# EAGLE schematic simple_sstc_halfbridge (EAGLE 9.6.2)
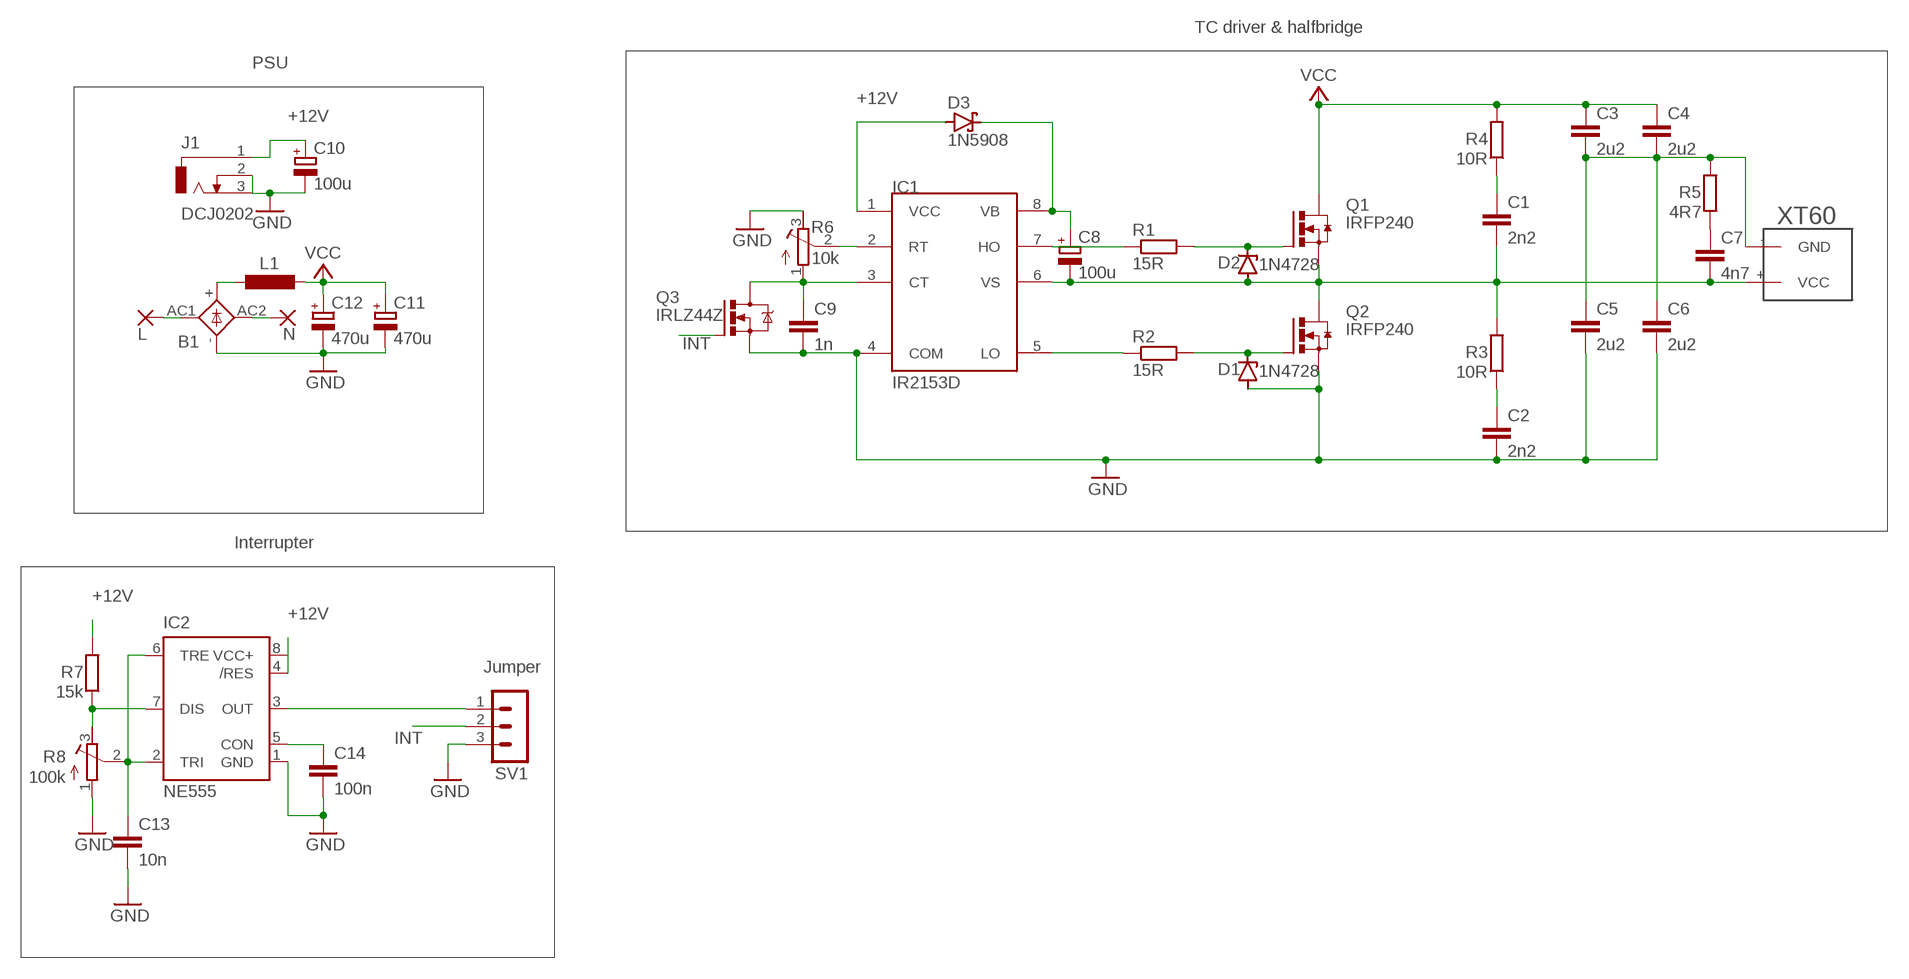
[diagram p0: schematic, sheet 1]

## Parts
B1  2KBP  [2KBP]
C1  2n2  C7.5/3  [C7.5B3]
C2  2n2  C7.5/3  [C7.5B3]
C3  2u2  C22/6  [C22.5B6]
C4  2u2  C22/6  [C22.5B6]
C5  2u2  C22/6  [C22.5B6]
C6  2u2  C22/6  [C22.5B6]
C7  4n7  C7.5/3  [C7.5B3]
C8  100u  CPOL-EUE2.5-7  [E2,5-7]
C9  1n  C-EU025-024X044  [C025-024X044]
C10  100u  CPOL-EUE2.5-7  [E2,5-7]
C11  470u  CPOL-EUE10-35  [EB35D]
C12  470u  CPOL-EUE10-35  [EB35D]
C13  10n  C-EU025-025X050  [C025-025X050]
C14  100n  C-EU025-025X050  [C025-025X050]
D1  1N4728  [DO41Z10]
D2  1N4728  [DO41Z10]
D3  1N5908  [C4111-15]
IC1  IR2153D  [DIL08]
IC2  NE555  [DIL-08]
J1  DCJ0202  [DCJ0202]
L  3,81/1,4  [3,81/1,4]
L1  L-EUTJ4-U2  [TJ4-U2]
N  3,81/1,4  [3,81/1,4]
Q1  IRFP240  [TO247BV]
Q2  IRFP240  [TO247BV]
Q3  IRLZ44Z  [TO220BH]
R1  15R  R-EU_VMTA55  [VMTA55]
R2  15R  R-EU_VMTA55  [VMTA55]
R3  10R  R-EU_V234/12  [V234/12]
R4  10R  R-EU_V234/12  [V234/12]
R5  4R7  R-EU_V234/12  [V234/12]
R6  10k  R-TRIMM3339P  [RTRIM3339P]
R7  15k  R-EU_VMTA55  [VMTA55]
R8  100k  R-TRIMM3339P  [RTRIM3339P]
SV1  MA03-1  [MA03-1]
U$1  XT60  [XT60]

## Nets
+12V: C10.+ D3.A IC1.1(VCC) IC2.4(/RES) IC2.8(VCC+) J1.1 R7.2
GND: B1.- C2.2 C5.2 C6.2 C9.2 C10.- C11.- C12.- C13.2 C14.2 D1.A IC1.4(COM) IC2.1(GND) J1.2 J1.3 Q2.S Q3.S R6.3(E) R8.1(A) SV1.3
INT: Q3.G SV1.2
N$1: C7.1 R5.1
N$2: IC1.7(HO) R1.1
N$3: D2.C Q1.G R1.2
N$4: C3.2 C4.2 C5.1 C6.1 R5.2 U$1.-(GND)
N$5: C9.1 IC1.3(CT) Q3.D R6.1(A)
N$6: D1.C Q2.G R2.2
N$7: IC1.5(LO) R2.1
N$8: C2.1 R3.1
N$9: C1.1 R4.1
N$10: IC2.7(DIS) R7.1 R8.3(E)
N$11: IC1.2(RT) R6.2(S)
N$12: B1.AC1 L.1(P)
N$13: B1.AC2 N.1(P)
N$14: C13.1 IC2.2(TRI) IC2.6(TRE) R8.2(S)
N$15: B1.+ L1.1
N$17: C14.1 IC2.5(CON)
N$19: IC2.3(OUT) SV1.1
VB: C8.+ D3.C IC1.8(VB)
VCC: C3.1 C4.1 C11.+ C12.+ L1.2 Q1.D R4.2
VS: C1.2 C7.2 C8.- D2.A IC1.6(VS) Q1.S Q2.D R3.2 U$1.+(VCC)

## Notes on the sheet
- TC driver & halfbridge
- PSU
- Interrupter
- Jumper

## Library data of the parts
B1 = rectifier:2KBP: RECTIFIER grid 3 x 3,81 mm
C1-C7 = capacitor-wima:C: CAPACITOR naming: grid - package width
C8 C10-C12 = rcl:CPOL-EU: POLARIZED CAPACITOR, European symbol; SPICEPREFIX: C
C9 C13 C14 = rcl:C-EU: CAPACITOR, European symbol; SPICEPREFIX: C
D1 D2 = diode:1N4728: Z DIODE 3.3 V, 1W, 5 percent
D3 = diode:1N5908: DIODE schottky
IC1 = irs:IR2153
IC2 = st-microelectronics:NE555: General purpose bipolar Timer; MF: Arrow Electronics; MPN: NE555N; OC_FARNELL: 1467742; OC_NEWARK: 89K1486
J1 = con-jack:DCJ0202: DC POWER JACK Source: DCJ0202.pdf; OC_FARNELL: unknown; OC_NEWARK: unknown
L N = wirepad:3,81/1,4: THROUGH-HOLE PAD
L1 = rcl:L-EU: INDUCTOR, European symbol; SPICEPREFIX: L
Q1 Q2 = transistor-power:IRFP240: HEXFET Power MosFet Source: http://www.irf.com/
Q3 = transistor-power:IRLZ44Z: N-Channel HEXFET® Power MOSFET Logic Level AUTOMOTIVE MOSFET Source: http://www.irf.com/product-info/datasheets/data/irlz44zpbf.pdf
R1-R5 R7 = rcl:R-EU_: RESISTOR, European symbol; SPICEPREFIX: R
R6 R8 = rcl:R-TRIMM: Trimm resistor; SPICEMODEL: X; SPICEPREFIXL: POT
SV1 = con-lstb:MA03-1: PIN HEADER; OC_FARNELL: unknown; OC_NEWARK: unknown
U$1 = XT60:XT60: XT60